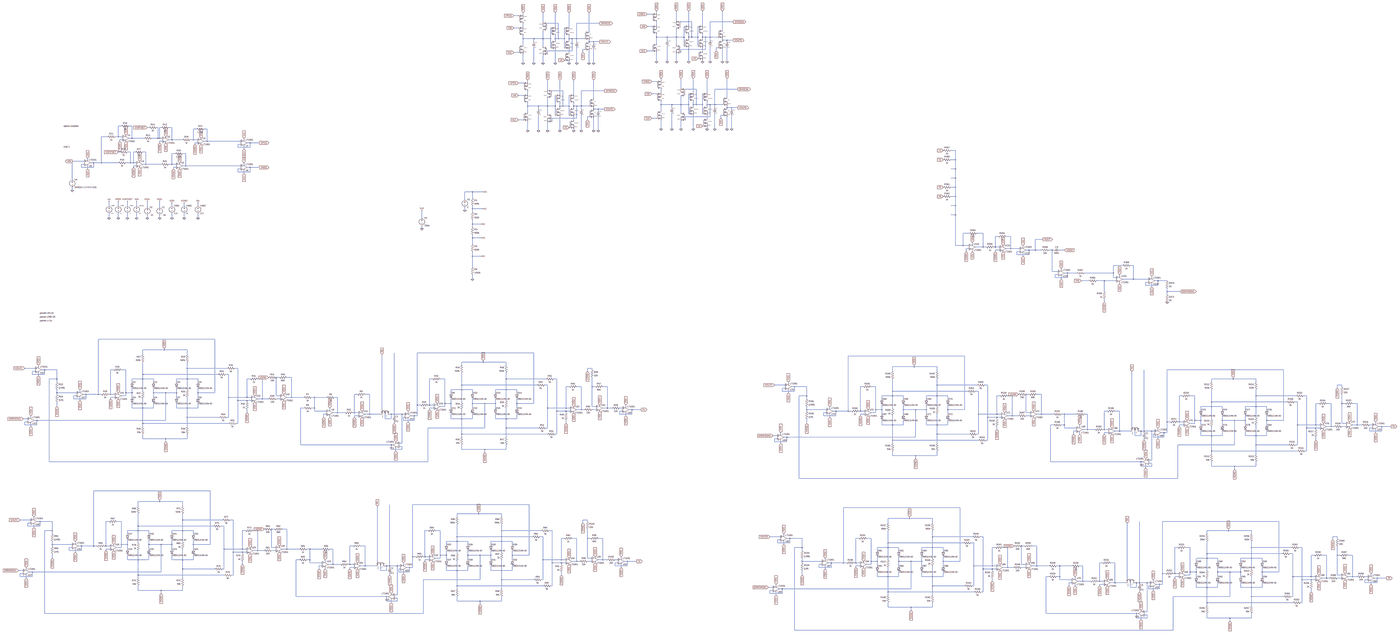
[diagram p0: schematic OZ_4_pure_curves.asc, whole sheet]
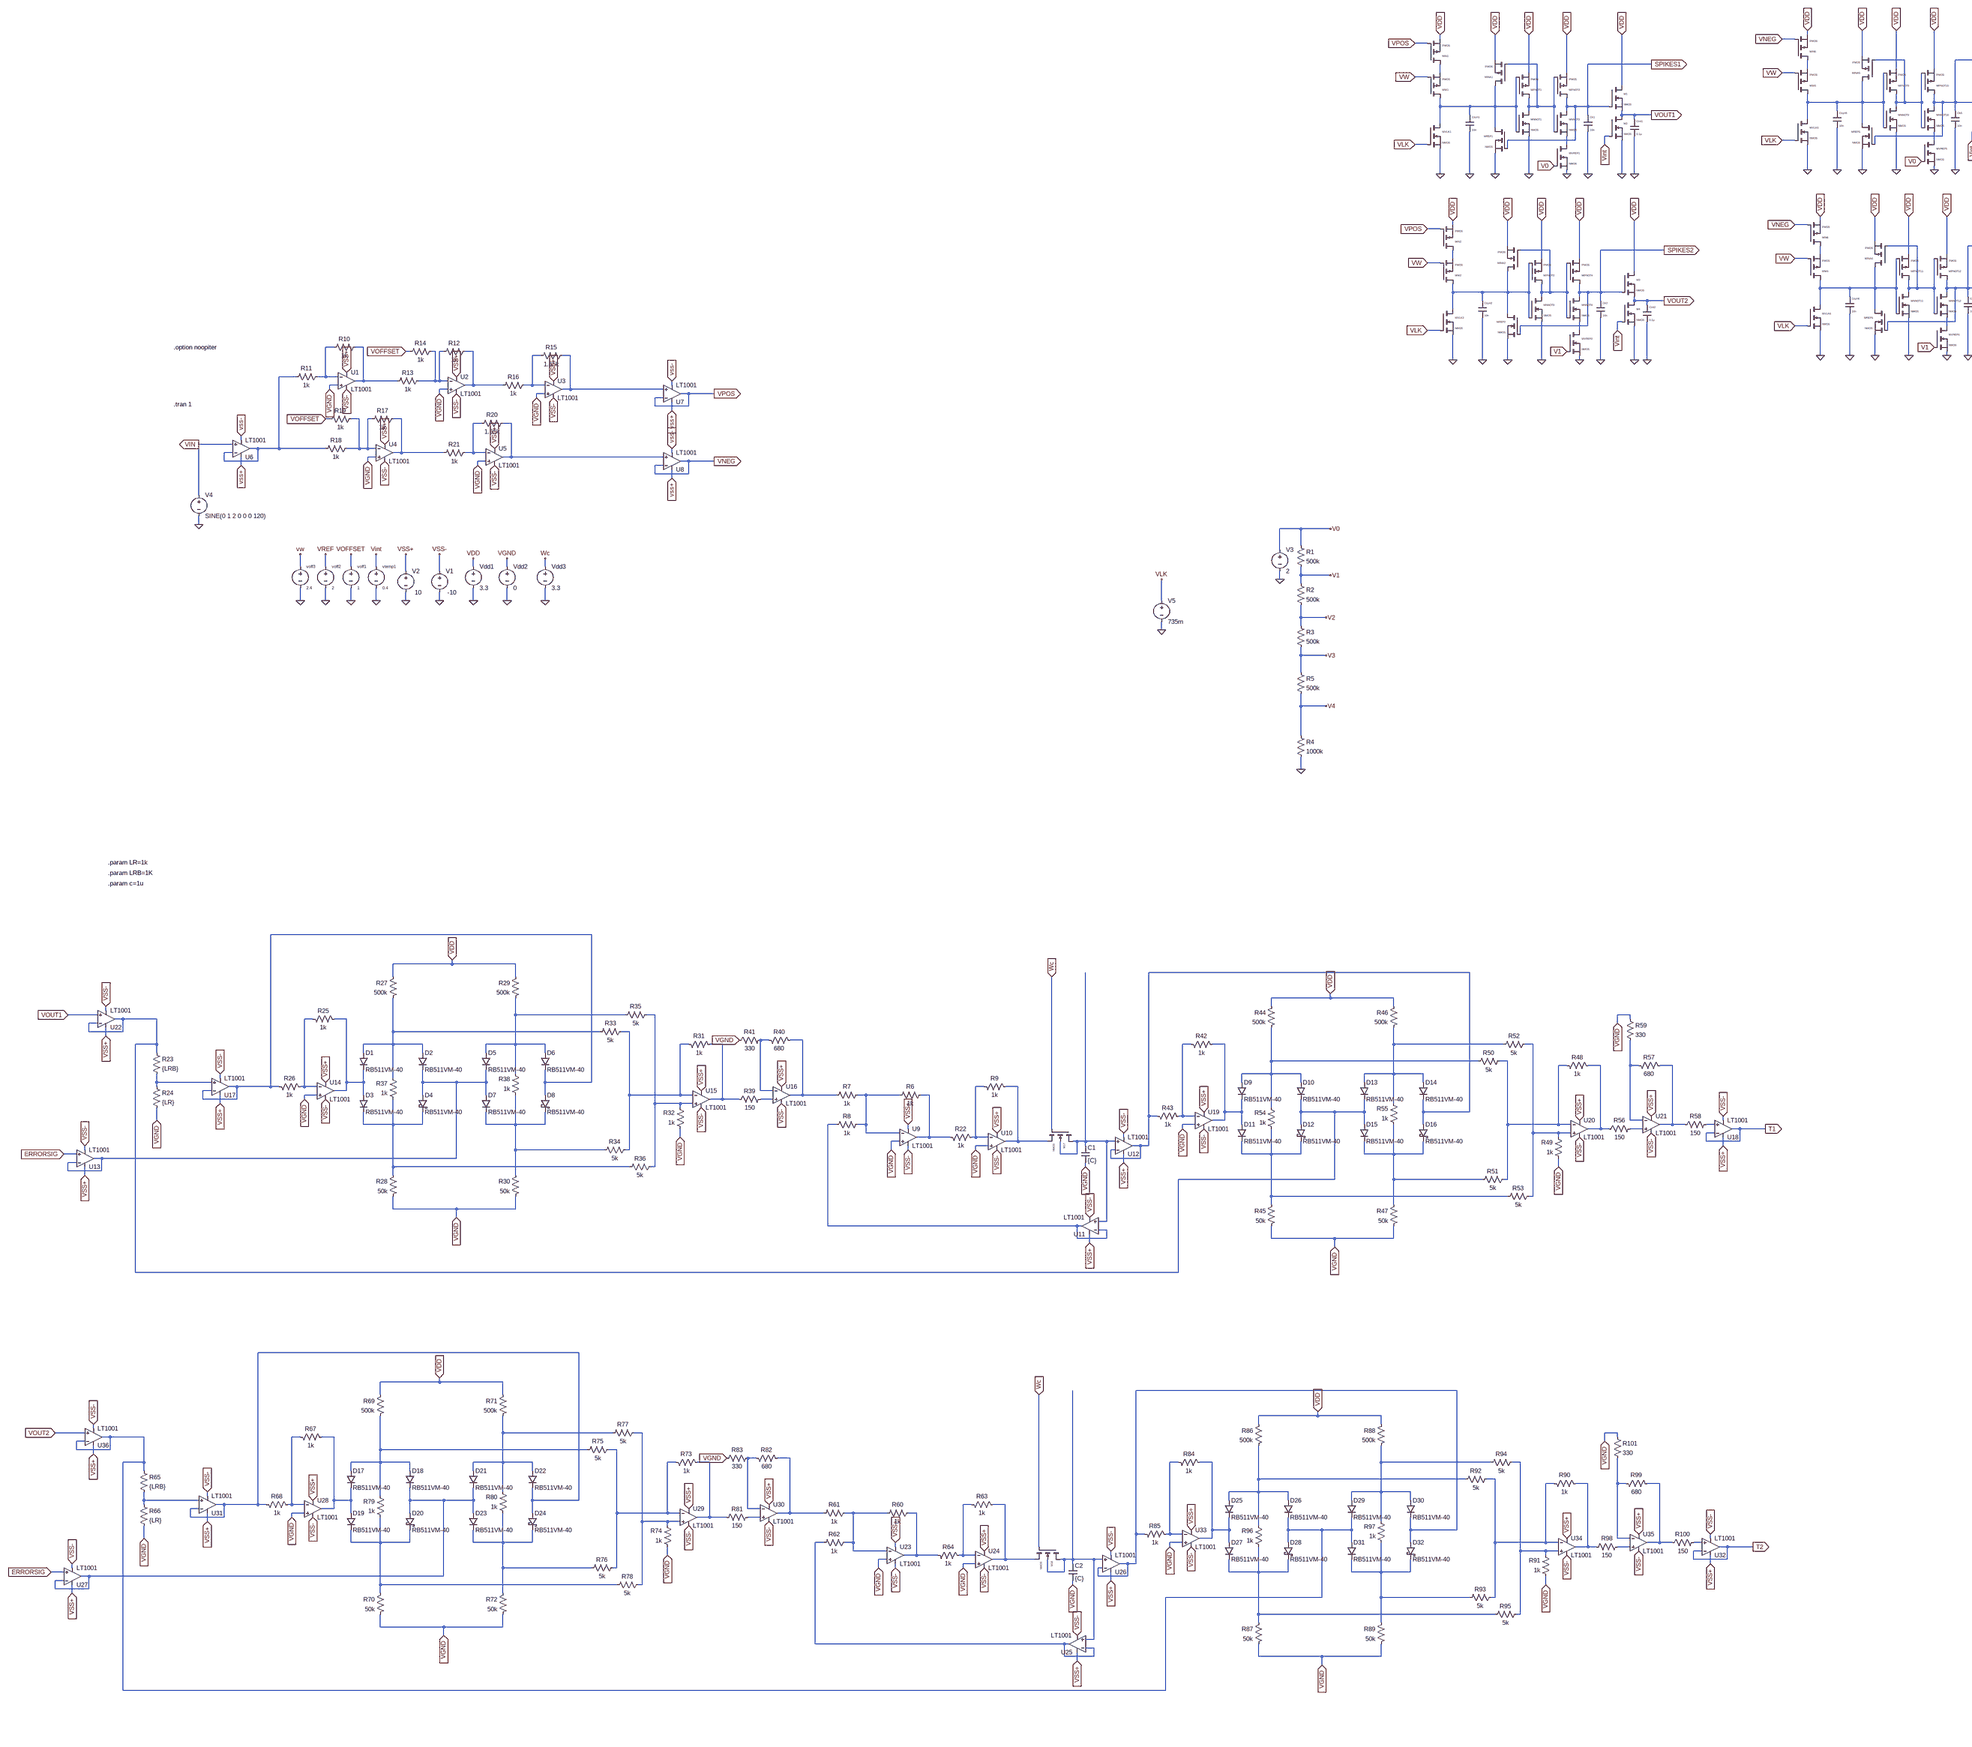
[diagram p1: schematic OZ_4_pure_curves.asc, part, row 1 of 1, column 1 of 2]
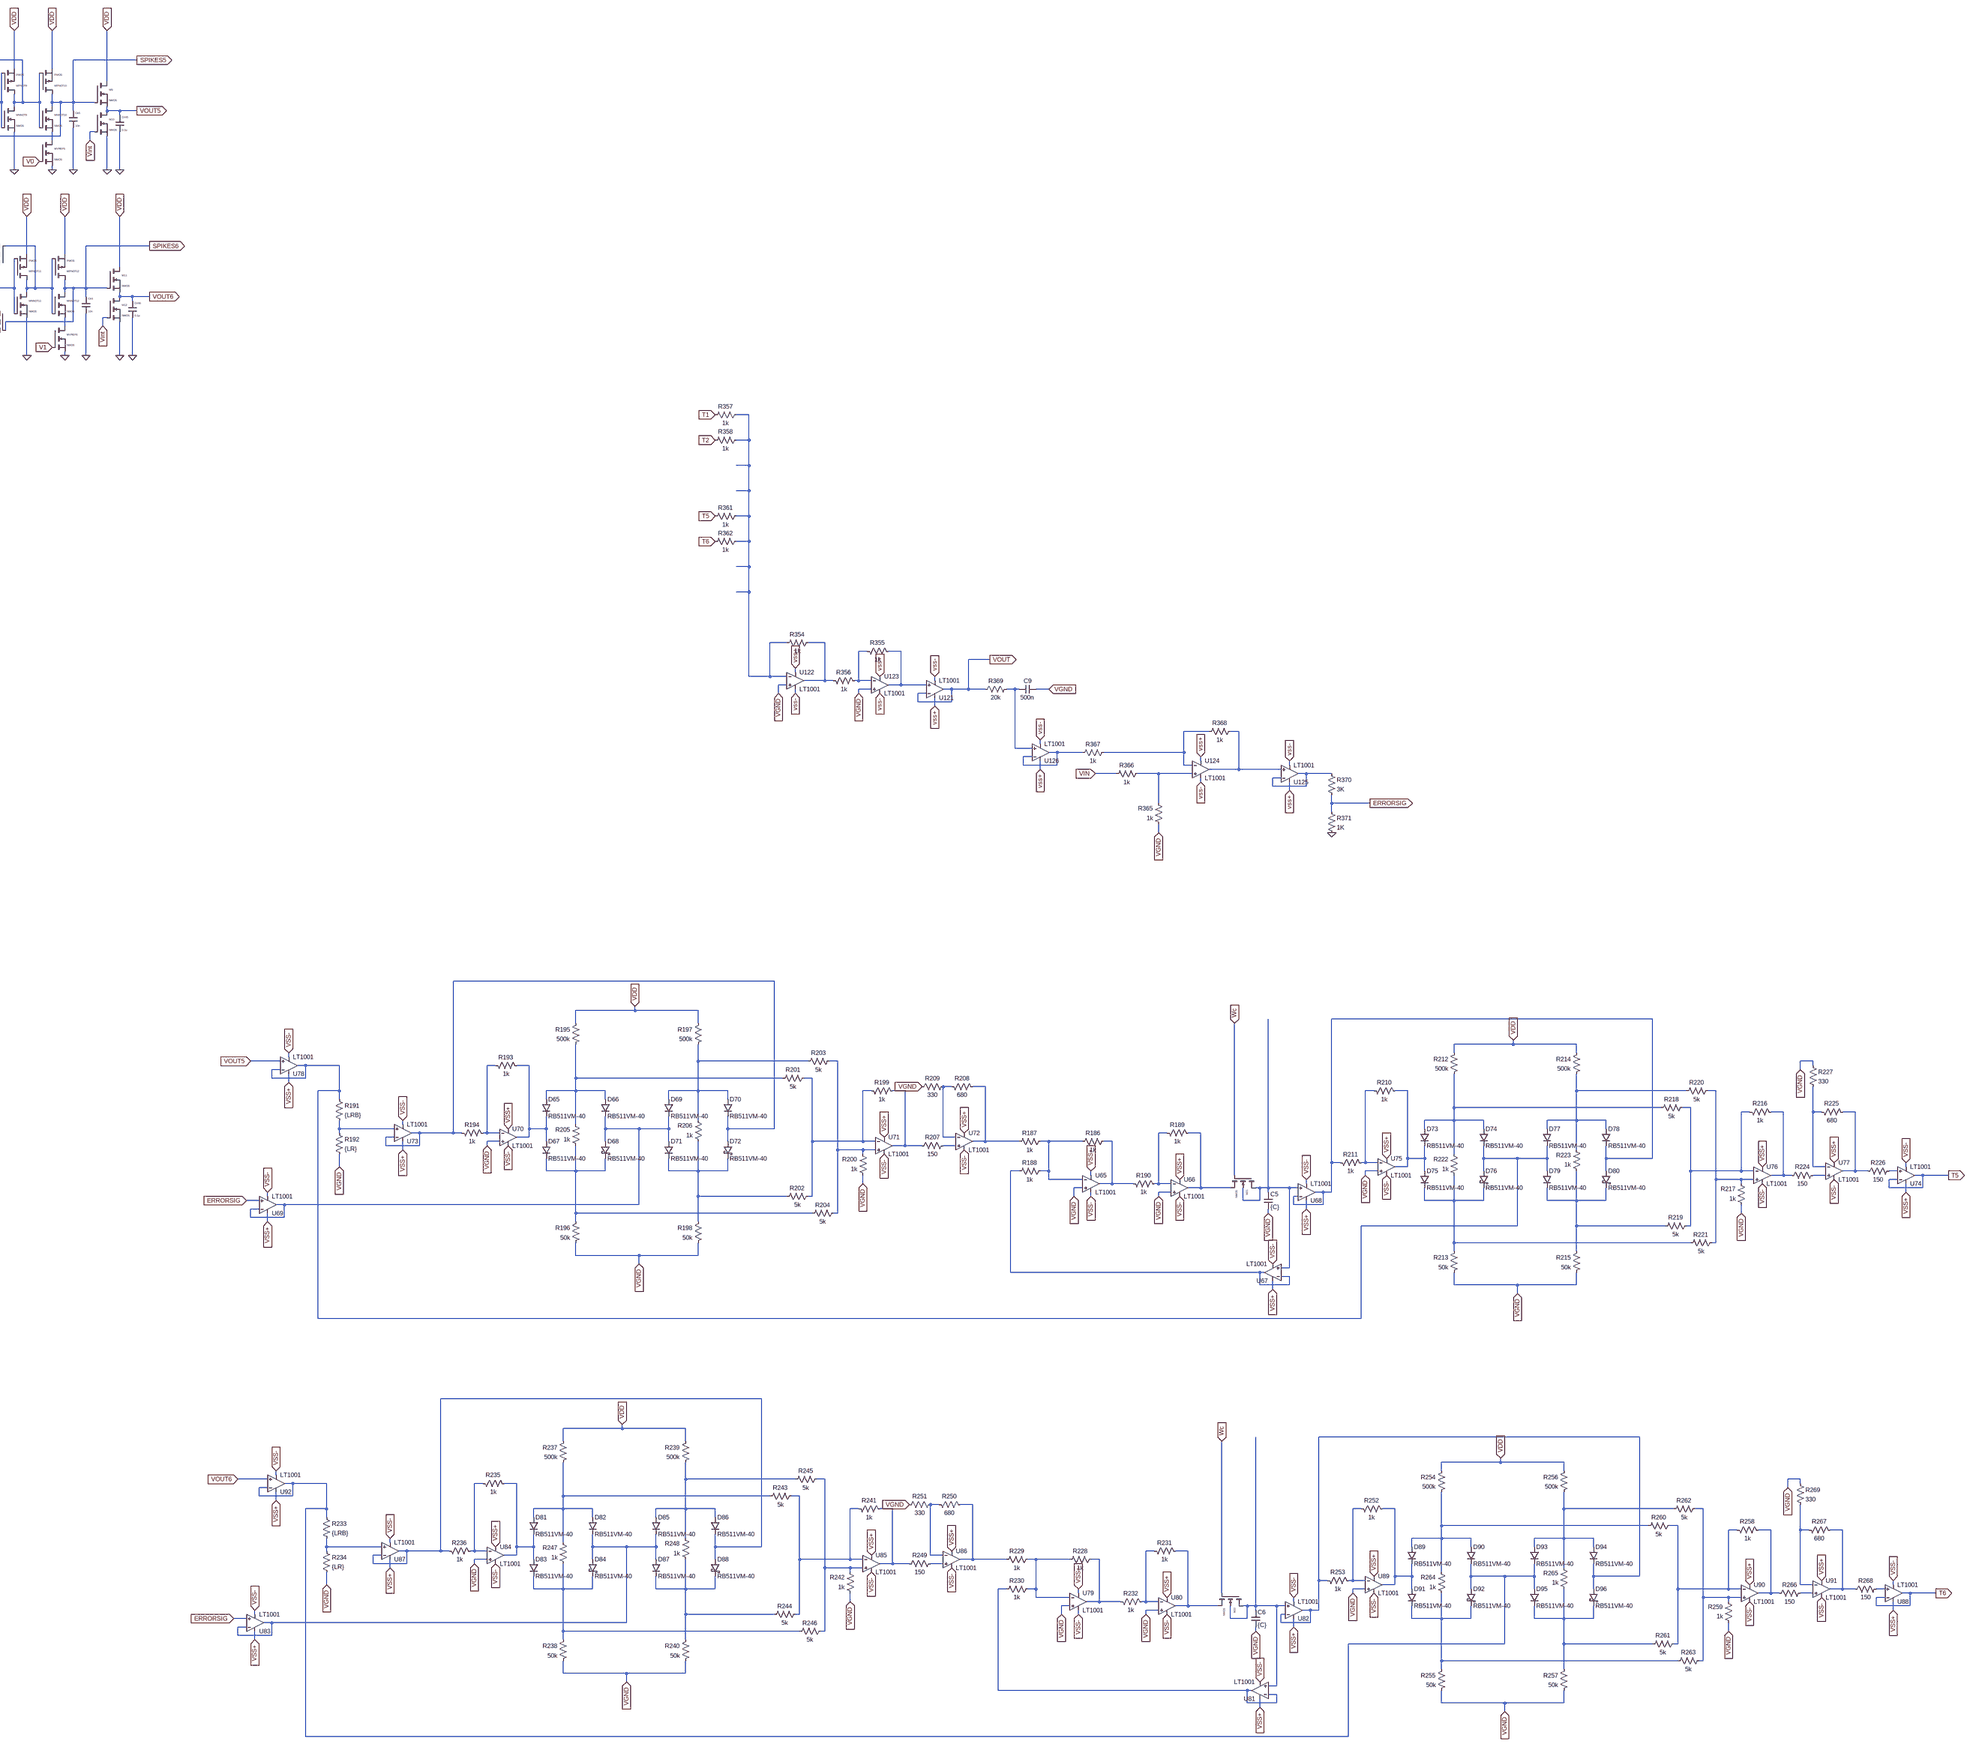
[diagram p2: schematic OZ_4_pure_curves.asc, part, row 1 of 1, column 2 of 2]
* OZ_4_pure_curves.asc
vtemp1 Vint 0 0.4
Vdd1 VDD 0 3.3
V1 VSS- 0 -10
V2 VSS+ 0 10
voff1 VOFFSET 0 1
voff2 VREF 0 2
voff3 vw 0 2.4
Vdd2 VGND 0 0
XU1 VGND N017 VSS+ VSS- N018 LT1001  ; pins In+ In- V+ V- OUT
R10 N018 N017 1k
R11 N017 N023 1k
XU2 VGND N019 VSS+ VSS- N020 LT1001  ; pins In+ In- V+ V- OUT
R12 N020 N019 1k
R13 N019 N018 1k
R14 N019 VOFFSET 1k
XU3 VGND N021 VSS+ VSS- N022 LT1001  ; pins In+ In- V+ V- OUT
R15 N022 N021 1.65k
R16 N021 N020 1k
XU4 VGND N025 VSS+ VSS- N026 LT1001  ; pins In+ In- V+ V- OUT
R17 N026 N025 1k
R18 N025 N023 1k
R19 N025 VOFFSET 1k
XU5 VGND N027 VSS+ VSS- N028 LT1001  ; pins In+ In- V+ V- OUT
R20 N028 N027 1.65k
R21 N027 N026 1k
XU6 VIN N023 VSS+ VSS- N023 LT1001  ; pins In+ In- V+ V- OUT
XU7 N022 VPOS VSS+ VSS- VPOS LT1001  ; pins In+ In- V+ V- OUT
XU8 N028 VNEG VSS+ VSS- VNEG LT1001  ; pins In+ In- V+ V- OUT
V4 VIN 0 SINE(0 1 2 0 0 0 120)
XU121 N031 VOUT VSS+ VSS- VOUT LT1001  ; pins In+ In- V+ V- OUT
XU122 VGND N024 VSS+ VSS- N029 LT1001  ; pins In+ In- V+ V- OUT
R354 N029 N024 1k
XU123 VGND N030 VSS+ VSS- N031 LT1001  ; pins In+ In- V+ V- OUT
R355 N030 N031 1k
R356 N029 N030 1k
R357 N024 T1 1k
R358 N024 T2 1k
R361 N024 T5 1k
R362 N024 T6 1k
M17 N096 Wc N071 N096 NMOS
C1 N096 VGND {C} IC=0
XU9 VGND N079 VSS+ VSS- N080 LT1001  ; pins In+ In- V+ V- OUT
R6 N080 N079 1k
R7 N079 N050 1k
R8 N079 N089 1k
XU10 VGND N070 VSS+ VSS- N071 LT1001  ; pins In+ In- V+ V- OUT
R9 N070 N071 1k
R22 N080 N070 1k
XU11 N096 N089 VSS+ VSS- N089 LT1001  ; pins In+ In- V+ V- OUT
XU12 N096 N039 VSS+ VSS- N039 LT1001  ; pins In+ In- V+ V- OUT
R23 N043 N068 {LRB}
R24 N068 VGND {LR}
XU13 ERRORSIG N069 VSS+ VSS- N069 LT1001  ; pins In+ In- V+ V- OUT
D1 N047 N045 RB511VM-40
XU14 VGND N044 VSS+ VSS- N045 LT1001  ; pins In+ In- V+ V- OUT
R25 N044 N045 1k
R26 N038 N044 1k
D2 N047 N069 RB511VM-40
D3 N045 N087 RB511VM-40
D4 N069 N087 RB511VM-40
R27 VDD N047 500k
R28 N087 VGND 50k
D5 N041 N069 RB511VM-40
D6 N041 N038 RB511VM-40
D7 N069 N088 RB511VM-40
D8 N038 N088 RB511VM-40
R29 VDD N041 500k
R30 N088 VGND 50k
XU15 N042 N048 VSS+ VSS- N051 LT1001  ; pins In+ In- V+ V- OUT
R31 N048 N051 1k
R32 VGND N042 1k
R33 N048 N047 5k
R34 N048 N088 5k
R35 N042 N041 5k
R36 N042 N087 5k
R37 N087 N047 1k
R38 N088 N041 1k
R39 N051 N081 150
XU16 N081 N049 VSS+ VSS- N050 LT1001  ; pins In+ In- V+ V- OUT
R40 N049 N050 680
R41 VGND N049 330
XU17 N068 N038 VSS+ VSS- N038 LT1001  ; pins In+ In- V+ V- OUT
XU18 N090 T1 VSS+ VSS- T1 LT1001  ; pins In+ In- V+ V- OUT
D9 N056 N053 RB511VM-40
XU19 VGND N052 VSS+ VSS- N053 LT1001  ; pins In+ In- V+ V- OUT
R42 N052 N053 1k
R43 N039 N052 1k
D10 N056 N043 RB511VM-40
D11 N053 N100 RB511VM-40
D12 N043 N100 RB511VM-40
R44 VDD N056 500k
R45 N100 VGND 50k
D13 N054 N043 RB511VM-40
D14 N054 N039 RB511VM-40
D15 N043 N101 RB511VM-40
D16 N039 N101 RB511VM-40
R46 VDD N054 500k
R47 N101 VGND 50k
XU20 N055 N057 VSS+ VSS- N060 LT1001  ; pins In+ In- V+ V- OUT
R48 N057 N060 1k
R49 VGND N055 1k
R50 N057 N056 5k
R51 N057 N101 5k
R52 N055 N054 5k
R53 N055 N100 5k
R54 N100 N056 1k
R55 N101 N054 1k
R56 N060 N091 150
XU21 N091 N061 VSS+ VSS- N062 LT1001  ; pins In+ In- V+ V- OUT
R57 N061 N062 680
R58 N062 N090 150
R59 VGND N061 330
XU22 VOUT1 N043 VSS+ VSS- N043 LT1001  ; pins In+ In- V+ V- OUT
M18 N168 Wc N143 N168 NMOS
C2 N168 VGND {C} IC=0
XU23 VGND N151 VSS+ VSS- N152 LT1001  ; pins In+ In- V+ V- OUT
R60 N152 N151 1k
R61 N151 N122 1k
R62 N151 N161 1k
XU24 VGND N142 VSS+ VSS- N143 LT1001  ; pins In+ In- V+ V- OUT
R63 N142 N143 1k
R64 N152 N142 1k
XU25 N168 N161 VSS+ VSS- N161 LT1001  ; pins In+ In- V+ V- OUT
XU26 N168 N111 VSS+ VSS- N111 LT1001  ; pins In+ In- V+ V- OUT
R65 N115 N140 {LRB}
R66 N140 VGND {LR}
XU27 ERRORSIG N141 VSS+ VSS- N141 LT1001  ; pins In+ In- V+ V- OUT
D17 N119 N117 RB511VM-40
XU28 VGND N116 VSS+ VSS- N117 LT1001  ; pins In+ In- V+ V- OUT
R67 N116 N117 1k
R68 N110 N116 1k
D18 N119 N141 RB511VM-40
D19 N117 N159 RB511VM-40
D20 N141 N159 RB511VM-40
R69 VDD N119 500k
R70 N159 VGND 50k
D21 N113 N141 RB511VM-40
D22 N113 N110 RB511VM-40
D23 N141 N160 RB511VM-40
D24 N110 N160 RB511VM-40
R71 VDD N113 500k
R72 N160 VGND 50k
XU29 N114 N120 VSS+ VSS- N123 LT1001  ; pins In+ In- V+ V- OUT
R73 N120 N123 1k
R74 VGND N114 1k
R75 N120 N119 5k
R76 N120 N160 5k
R77 N114 N113 5k
R78 N114 N159 5k
R79 N159 N119 1k
R80 N160 N113 1k
R81 N123 N153 150
XU30 N153 N121 VSS+ VSS- N122 LT1001  ; pins In+ In- V+ V- OUT
R82 N121 N122 680
R83 VGND N121 330
XU31 N140 N110 VSS+ VSS- N110 LT1001  ; pins In+ In- V+ V- OUT
XU32 N162 T2 VSS+ VSS- T2 LT1001  ; pins In+ In- V+ V- OUT
D25 N128 N125 RB511VM-40
XU33 VGND N124 VSS+ VSS- N125 LT1001  ; pins In+ In- V+ V- OUT
R84 N124 N125 1k
R85 N111 N124 1k
D26 N128 N115 RB511VM-40
D27 N125 N172 RB511VM-40
D28 N115 N172 RB511VM-40
R86 VDD N128 500k
R87 N172 VGND 50k
D29 N126 N115 RB511VM-40
D30 N126 N111 RB511VM-40
D31 N115 N173 RB511VM-40
D32 N111 N173 RB511VM-40
R88 VDD N126 500k
R89 N173 VGND 50k
XU34 N127 N129 VSS+ VSS- N132 LT1001  ; pins In+ In- V+ V- OUT
R90 N129 N132 1k
R91 VGND N127 1k
R92 N129 N128 5k
R93 N129 N173 5k
R94 N127 N126 5k
R95 N127 N172 5k
R96 N172 N128 1k
R97 N173 N126 1k
R98 N132 N163 150
XU35 N163 N133 VSS+ VSS- N134 LT1001  ; pins In+ In- V+ V- OUT
R99 N133 N134 680
R100 N134 N162 150
R101 VGND N133 330
XU36 VOUT2 N115 VSS+ VSS- N115 LT1001  ; pins In+ In- V+ V- OUT
M21 N107 Wc N095 N107 NMOS
C5 N107 VGND {C} IC=0
XU65 VGND N097 VSS+ VSS- N098 LT1001  ; pins In+ In- V+ V- OUT
R186 N098 N097 1k
R187 N097 N073 1k
R188 N097 N104 1k
XU66 VGND N094 VSS+ VSS- N095 LT1001  ; pins In+ In- V+ V- OUT
R189 N094 N095 1k
R190 N098 N094 1k
XU67 N107 N104 VSS+ VSS- N104 LT1001  ; pins In+ In- V+ V- OUT
XU68 N107 N046 VSS+ VSS- N046 LT1001  ; pins In+ In- V+ V- OUT
R191 N063 N092 {LRB}
R192 N092 VGND {LR}
XU69 ERRORSIG N093 VSS+ VSS- N093 LT1001  ; pins In+ In- V+ V- OUT
D65 N066 N065 RB511VM-40
XU70 VGND N064 VSS+ VSS- N065 LT1001  ; pins In+ In- V+ V- OUT
R193 N064 N065 1k
R194 N040 N064 1k
D66 N066 N093 RB511VM-40
D67 N065 N102 RB511VM-40
D68 N093 N102 RB511VM-40
R195 VDD N066 500k
R196 N102 VGND 50k
D69 N058 N093 RB511VM-40
D70 N058 N040 RB511VM-40
D71 N093 N103 RB511VM-40
D72 N040 N103 RB511VM-40
R197 VDD N058 500k
R198 N103 VGND 50k
XU71 N059 N067 VSS+ VSS- N074 LT1001  ; pins In+ In- V+ V- OUT
R199 N067 N074 1k
R200 VGND N059 1k
R201 N067 N066 5k
R202 N067 N103 5k
R203 N059 N058 5k
R204 N059 N102 5k
R205 N102 N066 1k
R206 N103 N058 1k
R207 N074 N099 150
XU72 N099 N072 VSS+ VSS- N073 LT1001  ; pins In+ In- V+ V- OUT
R208 N072 N073 680
R209 VGND N072 330
XU73 N092 N040 VSS+ VSS- N040 LT1001  ; pins In+ In- V+ V- OUT
XU74 N105 T5 VSS+ VSS- T5 LT1001  ; pins In+ In- V+ V- OUT
D73 N082 N076 RB511VM-40
XU75 VGND N075 VSS+ VSS- N076 LT1001  ; pins In+ In- V+ V- OUT
R210 N075 N076 1k
R211 N046 N075 1k
D74 N082 N063 RB511VM-40
D75 N076 N108 RB511VM-40
D76 N063 N108 RB511VM-40
R212 VDD N082 500k
R213 N108 VGND 50k
D77 N077 N063 RB511VM-40
D78 N077 N046 RB511VM-40
D79 N063 N109 RB511VM-40
D80 N046 N109 RB511VM-40
R214 VDD N077 500k
R215 N109 VGND 50k
XU76 N078 N083 VSS+ VSS- N084 LT1001  ; pins In+ In- V+ V- OUT
R216 N083 N084 1k
R217 VGND N078 1k
R218 N083 N082 5k
R219 N083 N109 5k
R220 N078 N077 5k
R221 N078 N108 5k
R222 N108 N082 1k
R223 N109 N077 1k
R224 N084 N106 150
XU77 N106 N085 VSS+ VSS- N086 LT1001  ; pins In+ In- V+ V- OUT
R225 N085 N086 680
R226 N086 N105 150
R227 VGND N085 330
XU78 VOUT5 N063 VSS+ VSS- N063 LT1001  ; pins In+ In- V+ V- OUT
M22 N179 Wc N167 N179 NMOS
C6 N179 VGND {C} IC=0
XU79 VGND N169 VSS+ VSS- N170 LT1001  ; pins In+ In- V+ V- OUT
R228 N170 N169 1k
R229 N169 N145 1k
R230 N169 N176 1k
XU80 VGND N166 VSS+ VSS- N167 LT1001  ; pins In+ In- V+ V- OUT
R231 N166 N167 1k
R232 N170 N166 1k
XU81 N179 N176 VSS+ VSS- N176 LT1001  ; pins In+ In- V+ V- OUT
XU82 N179 N118 VSS+ VSS- N118 LT1001  ; pins In+ In- V+ V- OUT
R233 N135 N164 {LRB}
R234 N164 VGND {LR}
XU83 ERRORSIG N165 VSS+ VSS- N165 LT1001  ; pins In+ In- V+ V- OUT
D81 N138 N137 RB511VM-40
XU84 VGND N136 VSS+ VSS- N137 LT1001  ; pins In+ In- V+ V- OUT
R235 N136 N137 1k
R236 N112 N136 1k
D82 N138 N165 RB511VM-40
D83 N137 N174 RB511VM-40
D84 N165 N174 RB511VM-40
R237 VDD N138 500k
R238 N174 VGND 50k
D85 N130 N165 RB511VM-40
D86 N130 N112 RB511VM-40
D87 N165 N175 RB511VM-40
D88 N112 N175 RB511VM-40
R239 VDD N130 500k
R240 N175 VGND 50k
XU85 N131 N139 VSS+ VSS- N146 LT1001  ; pins In+ In- V+ V- OUT
R241 N139 N146 1k
R242 VGND N131 1k
R243 N139 N138 5k
R244 N139 N175 5k
R245 N131 N130 5k
R246 N131 N174 5k
R247 N174 N138 1k
R248 N175 N130 1k
R249 N146 N171 150
XU86 N171 N144 VSS+ VSS- N145 LT1001  ; pins In+ In- V+ V- OUT
R250 N144 N145 680
R251 VGND N144 330
XU87 N164 N112 VSS+ VSS- N112 LT1001  ; pins In+ In- V+ V- OUT
XU88 N177 T6 VSS+ VSS- T6 LT1001  ; pins In+ In- V+ V- OUT
D89 N154 N148 RB511VM-40
XU89 VGND N147 VSS+ VSS- N148 LT1001  ; pins In+ In- V+ V- OUT
R252 N147 N148 1k
R253 N118 N147 1k
D90 N154 N135 RB511VM-40
D91 N148 N180 RB511VM-40
D92 N135 N180 RB511VM-40
R254 VDD N154 500k
R255 N180 VGND 50k
D93 N149 N135 RB511VM-40
D94 N149 N118 RB511VM-40
D95 N135 N181 RB511VM-40
D96 N118 N181 RB511VM-40
R256 VDD N149 500k
R257 N181 VGND 50k
XU90 N150 N155 VSS+ VSS- N156 LT1001  ; pins In+ In- V+ V- OUT
R258 N155 N156 1k
R259 VGND N150 1k
R260 N155 N154 5k
R261 N155 N181 5k
R262 N150 N149 5k
R263 N150 N180 5k
R264 N180 N154 1k
R265 N181 N149 1k
R266 N156 N178 150
XU91 N178 N157 VSS+ VSS- N158 LT1001  ; pins In+ In- V+ V- OUT
R267 N157 N158 680
R268 N158 N177 150
R269 VGND N157 330
XU92 VOUT6 N135 VSS+ VSS- N135 LT1001  ; pins In+ In- V+ V- OUT
XU124 N036 N033 VSS+ VSS- N034 LT1001  ; pins In+ In- V+ V- OUT
R365 VGND N036 1k
R366 N036 VIN 1k
R367 N033 N035 1k
R368 N034 N033 1k
XU125 N034 N037 VSS+ VSS- N037 LT1001  ; pins In+ In- V+ V- OUT
R369 VOUT N032 20k
C9 N032 VGND 500n
XU126 N032 N035 VSS+ VSS- N035 LT1001  ; pins In+ In- V+ V- OUT
R370 N037 ERRORSIG 3K
R371 ERRORSIG 0 1K
Vdd3 Wc 0 3.3
MW1 N006 vw N004 N004 PMOS
Csyn1 N006 0 10n V=4 Irms=162m Rser=0.395426 Lser=0 mfg="KEMET" pn="C0402C103K7PAC" type="X5R" IC=0
Ck1 SPIKES1 0 10n
MPNOT1 N002 N006 VDD VDD PMOS
MNNOT1 N002 N006 0 0 NMOS
MVREF1 N008 V0 0 0 NMOS
MREF1 N006 SPIKES1 0 0 NMOS
MVLK1 N006 VLK 0 0 NMOS
MINA1 N006 N002 VDD VDD PMOS
MIN1 N004 VPOS VDD VDD PMOS
MPNOT2 SPIKES1 N002 VDD VDD PMOS
MNNOT2 SPIKES1 N002 N008 N008 NMOS
M1 VDD SPIKES1 VOUT1 VOUT1 NMOS
M2 VOUT1 Vint 0 0 NMOS
Cint1 VOUT1 0 0.1µ
MW2 N014 vw N012 N012 PMOS
Csyn2 N014 0 10n V=4 Irms=162m Rser=0.395426 Lser=0 mfg="KEMET" pn="C0402C103K7PAC" type="X5R" IC=0
Ck2 SPIKES2 0 10n
MPNOT3 N010 N014 VDD VDD PMOS
MNNOT3 N010 N014 0 0 NMOS
MVREF2 N016 V1 0 0 NMOS
MREF2 N014 SPIKES2 0 0 NMOS
MVLK2 N014 VLK 0 0 NMOS
MINA2 N014 N010 VDD VDD PMOS
MIN2 N012 VPOS VDD VDD PMOS
MPNOT4 SPIKES2 N010 VDD VDD PMOS
MNNOT4 SPIKES2 N010 N016 N016 NMOS
M3 VDD SPIKES2 VOUT2 VOUT2 NMOS
M4 VOUT2 Vint 0 0 NMOS
Cint2 VOUT2 0 0.1µ
MW5 N005 vw N003 N003 PMOS
Csyn5 N005 0 10n V=4 Irms=162m Rser=0.395426 Lser=0 mfg="KEMET" pn="C0402C103K7PAC" type="X5R" IC=0
Ck5 SPIKES5 0 10n
MPNOT9 N001 N005 VDD VDD PMOS
MNNOT9 N001 N005 0 0 NMOS
MVREF5 N007 V0 0 0 NMOS
MREF5 N005 SPIKES5 0 0 NMOS
MVLK5 N005 VLK 0 0 NMOS
MINA5 N005 N001 VDD VDD PMOS
MIN5 N003 VNEG VDD VDD PMOS
MPNOT10 SPIKES5 N001 VDD VDD PMOS
MNNOT10 SPIKES5 N001 N007 N007 NMOS
M9 VDD SPIKES5 VOUT5 VOUT5 NMOS
M10 VOUT5 Vint 0 0 NMOS
Cint5 VOUT5 0 0.1µ
MW6 N013 vw N011 N011 PMOS
Csyn6 N013 0 10n V=4 Irms=162m Rser=0.395426 Lser=0 mfg="KEMET" pn="C0402C103K7PAC" type="X5R" IC=0
Ck6 SPIKES6 0 10n
MPNOT11 N009 N013 VDD VDD PMOS
MNNOT11 N009 N013 0 0 NMOS
MVREF6 N015 V1 0 0 NMOS
MREF6 N013 SPIKES6 0 0 NMOS
MVLK6 N013 VLK 0 0 NMOS
MINA6 N013 N009 VDD VDD PMOS
MIN6 N011 VNEG VDD VDD PMOS
MPNOT12 SPIKES6 N009 VDD VDD PMOS
MNNOT12 SPIKES6 N009 N015 N015 NMOS
M11 VDD SPIKES6 VOUT6 VOUT6 NMOS
M12 VOUT6 Vint 0 0 NMOS
Cint6 VOUT6 0 0.1µ
V3 V0 0 2
R1 V0 V1 500k
R2 V1 V2 500k
R3 V2 V3 500k
R4 V4 0 1000k
R5 V3 V4 500k
V5 VLK 0 735m
.model D D
.lib standard.dio
.model NMOS NMOS
.model PMOS PMOS
.lib standard.mos
.tran 1
.option noopiter
.param LR=1k
.param LRB=1K
.param c=1u
.lib LTC.lib
.backanno
.end